# Altium schematic sheet protection.SchDoc
size A4
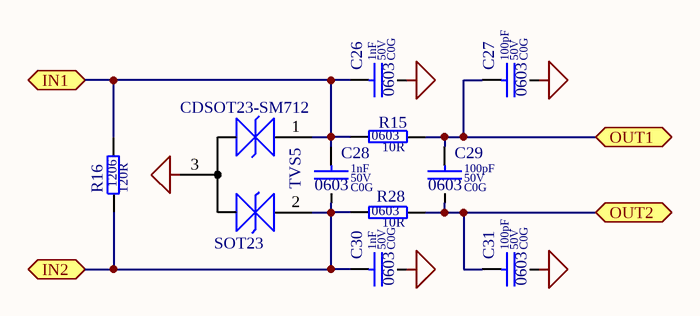
[diagram p0: protection.SchDoc]

## Parts
C26  value 1nF  Dielectric: C0G  Voltage: 50V  SCH_Footprint: 0603  [C_0603_1608]  (hidden comment: Ceramic C0G)
C27  value 100pF  Dielectric: C0G  Voltage: 50V  SCH_Footprint: 0603  [C_0603_1608]  (hidden comment: Ceramic C0G)
C28  value 1nF  Dielectric: C0G  Voltage: 50V  SCH_Footprint: 0603  [C_0603_1608]  (hidden comment: Ceramic C0G)
C29  value 100pF  Dielectric: C0G  Voltage: 50V  SCH_Footprint: 0603  [C_0603_1608]  (hidden comment: Ceramic C0G)
C30  value 1nF  Dielectric: C0G  Voltage: 50V  SCH_Footprint: 0603  [C_0603_1608]  (hidden comment: Ceramic C0G)
C31  value 100pF  Dielectric: C0G  Voltage: 50V  SCH_Footprint: 0603  [C_0603_1608]  (hidden comment: Ceramic C0G)
R15  value 10R  SCH_Footprint: 0603  [R_0603_1608]  (hidden comment: Resistor)
R16  value 120R  SCH_Footprint: 1206  [R_1206_3216]  (hidden comment: Resistor)
R28  value 10R  SCH_Footprint: 0603  [R_0603_1608]  (hidden comment: Resistor)
TVS5  value CDSOT23-SM712  SCH_Footprint: SOT23  [SOT23_N]  (hidden comment: TVS double bidirectional)

## Ports
IN1 (bidir), IN2 (bidir), OUT1 (bidir), OUT2 (bidir)

## Nets
GND: C26.2 C27.2 C30.2 C31.2 TVS5.3
IN1: C26.1 C28.1 R15.2 R16.2 TVS5.1 ; port IN1
IN2: C28.2 C30.1 R16.1 R28.2 TVS5.2 ; port IN2
OUT1: C27.1 C29.1 R15.1 ; port OUT1
OUT2: C29.2 C31.1 R28.1 ; port OUT2

## Library data of the parts
C26 C28 C30 = C_1nF_50V_C0G_0603_5: Capacitor; Manufacturer: Samsung; Manufacturer Part Number: CL10C102JB8NNNC; Tolerance (%): 5; Part Number: C_1nF_50V_C0G_0603_5; HelpURL: http://www.tme.eu/pl/Document/7da762c1dbaf553c64ad9c40d3603826/mlcc_samsung.pdf; Supplier 1: TME; Supplier Part Number 1: CL10C102JB8NNNC; Supplier 2: RS Components; Supplier 3: Farnell; Supplier Part Number 3: 3013440; Supplier 4: Mouser; Supplier 5: Digi-Key; Supplier Part Number 5: 1276-1091-1-ND; Supplier 6: LCSC; Supplier Part Number 6: C163508
C27 C29 C31 = C_100pF_50V_C0G_0603_5: Capacitor; Manufacturer: AVX; Manufacturer Part Number: 06035A101JAT2A; Tolerance (%): 5; Part Number: C_100pF_50V_C0G_0603_5; HelpURL: http://www.tme.eu/pl/Document/28556c2a4dfa60995042b7f5f1edb9ed/AVX-C0G.pdf; Supplier 1: TME; Supplier Part Number 1: 06035A101JAT2A; Supplier 2: RS Components; Supplier 3: Farnell; Supplier 4: Mouser; Supplier 5: Digi-Key; Supplier 6: LCSC
R15 R28 = R_10R_0603_1: Manufacturer: Royalohm; Manufacturer Part Number: 0603SAF100JT5E; Voltage: 50V; Power: 100mW; Tolerance: 1%; Part Number: R_10R_0603_1; HelpURL: http://www.tme.eu/pl/Document/b315665a56acbc42df513c99b390ad98/ROYALOHM-THICKFILM.pdf; Supplier 1: TME; Supplier Part Number 1: SMD0603-10R-1%; Supplier 2: RS Components; Supplier 3: Farnell; Supplier 4: Mouser; Supplier 5: Digi-Key; Supplier 6: LCSC
R16 = R_120R_1206_1: Manufacturer: Vishay; Manufacturer Part Number: CRCW1206120RFKEA; Voltage: 200V; Power: 250mW; Tolerance: 1%; Part Number: R_120R_1206_1; HelpURL: http://www.farnell.com/datasheets/2310790.pdf; Supplier 1: TME; Supplier 2: RS Components; Supplier Part Number 2: 6791787; Supplier 3: Farnell; Supplier Part Number 3: 1653057; Supplier 4: Mouser; Supplier Part Number 4: 71-CRCW1206-120-E3; Supplier 5: Digi-Key; Supplier Part Number 5: 541-120FCT-ND; Supplier 6: LCSC
TVS5 = TVS_CDSOT23-SM712: Manufacturer: Bourns; Voltage: 12V; Current: 17A; Part Number: TVS_CDSOT23-SM712; HelpURL: https://datasheet.octopart.com/CDSOT23-SM712-Bourns-datasheet-13451680.pdf; Manufacturer Part Number: CDSOT23-SM712; Supplier 1: TME; Supplier 2: RS Components; Supplier Part Number 2: 7673728; Supplier 3: Farnell; Supplier Part Number 3: 1824869; Supplier 4: Mouser; Supplier Part Number 4: 652-CDSOT23-SM712; Supplier 5: Digi-Key; Supplier Part Number 5: CDSOT23-SM712CT-ND; Supplier 6: LCSC